# EasyEDA Pro project Board1.epro

# Board PCB1
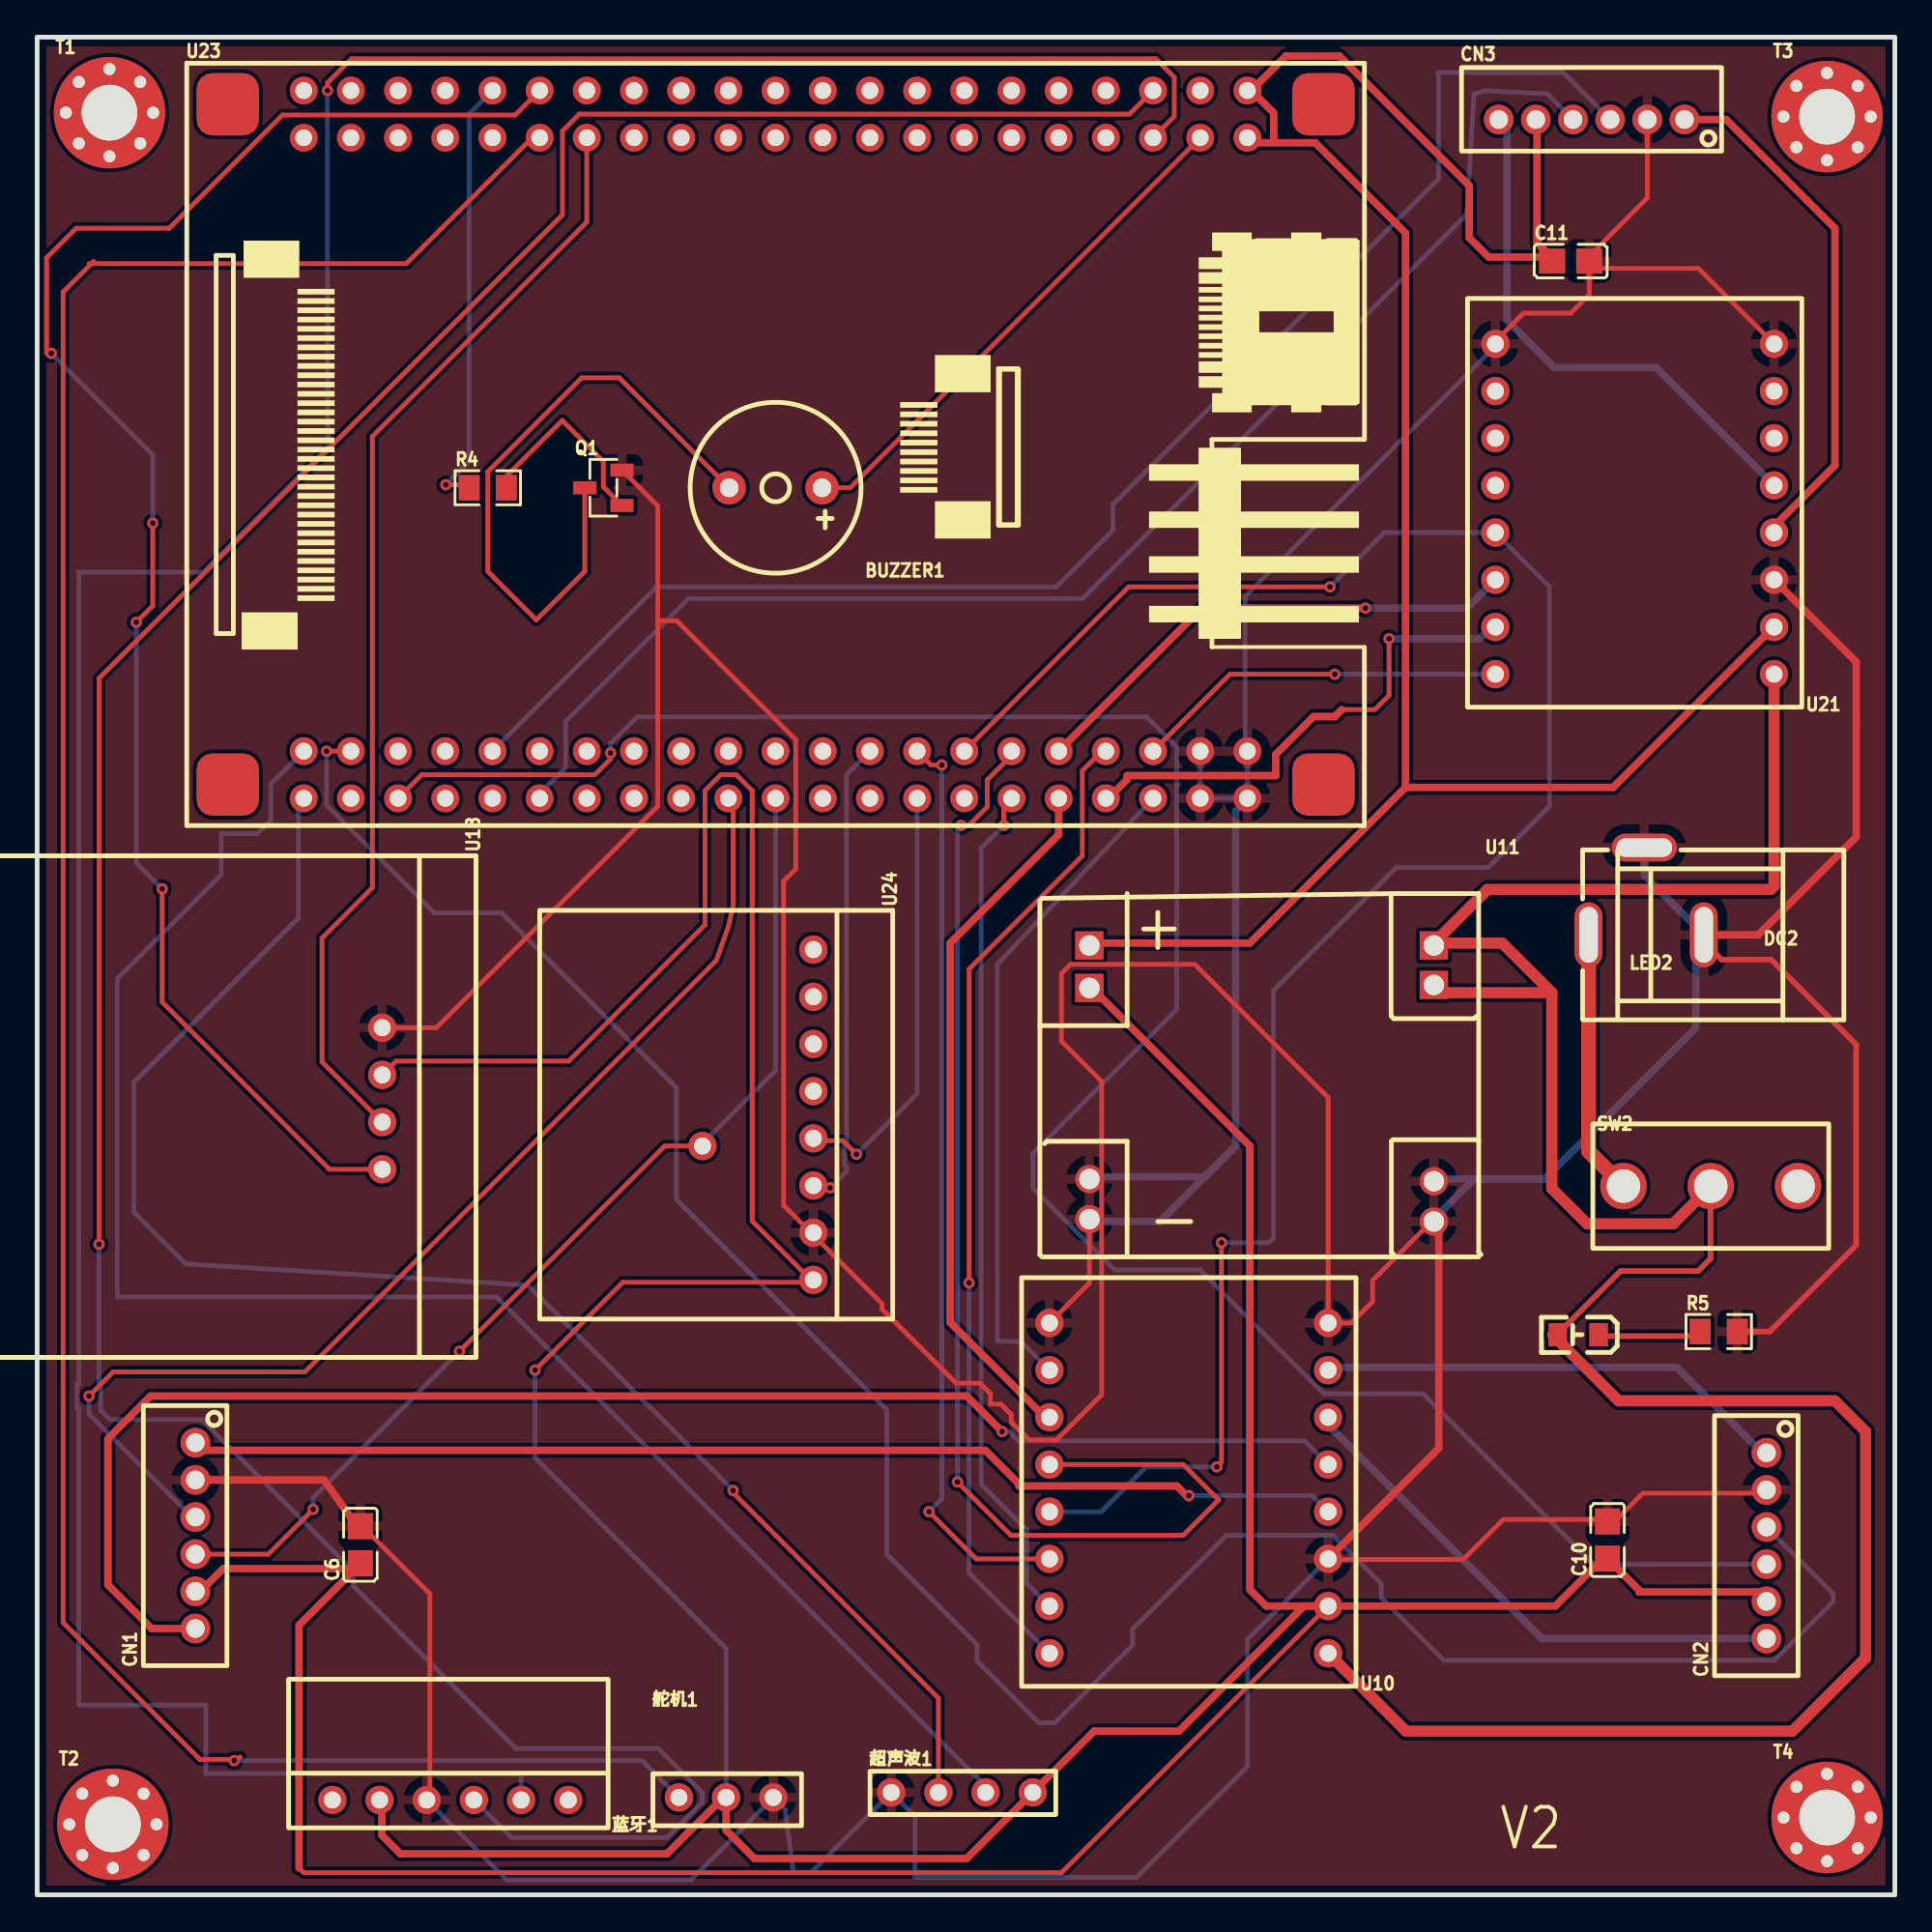
[diagram p0: board, top side]
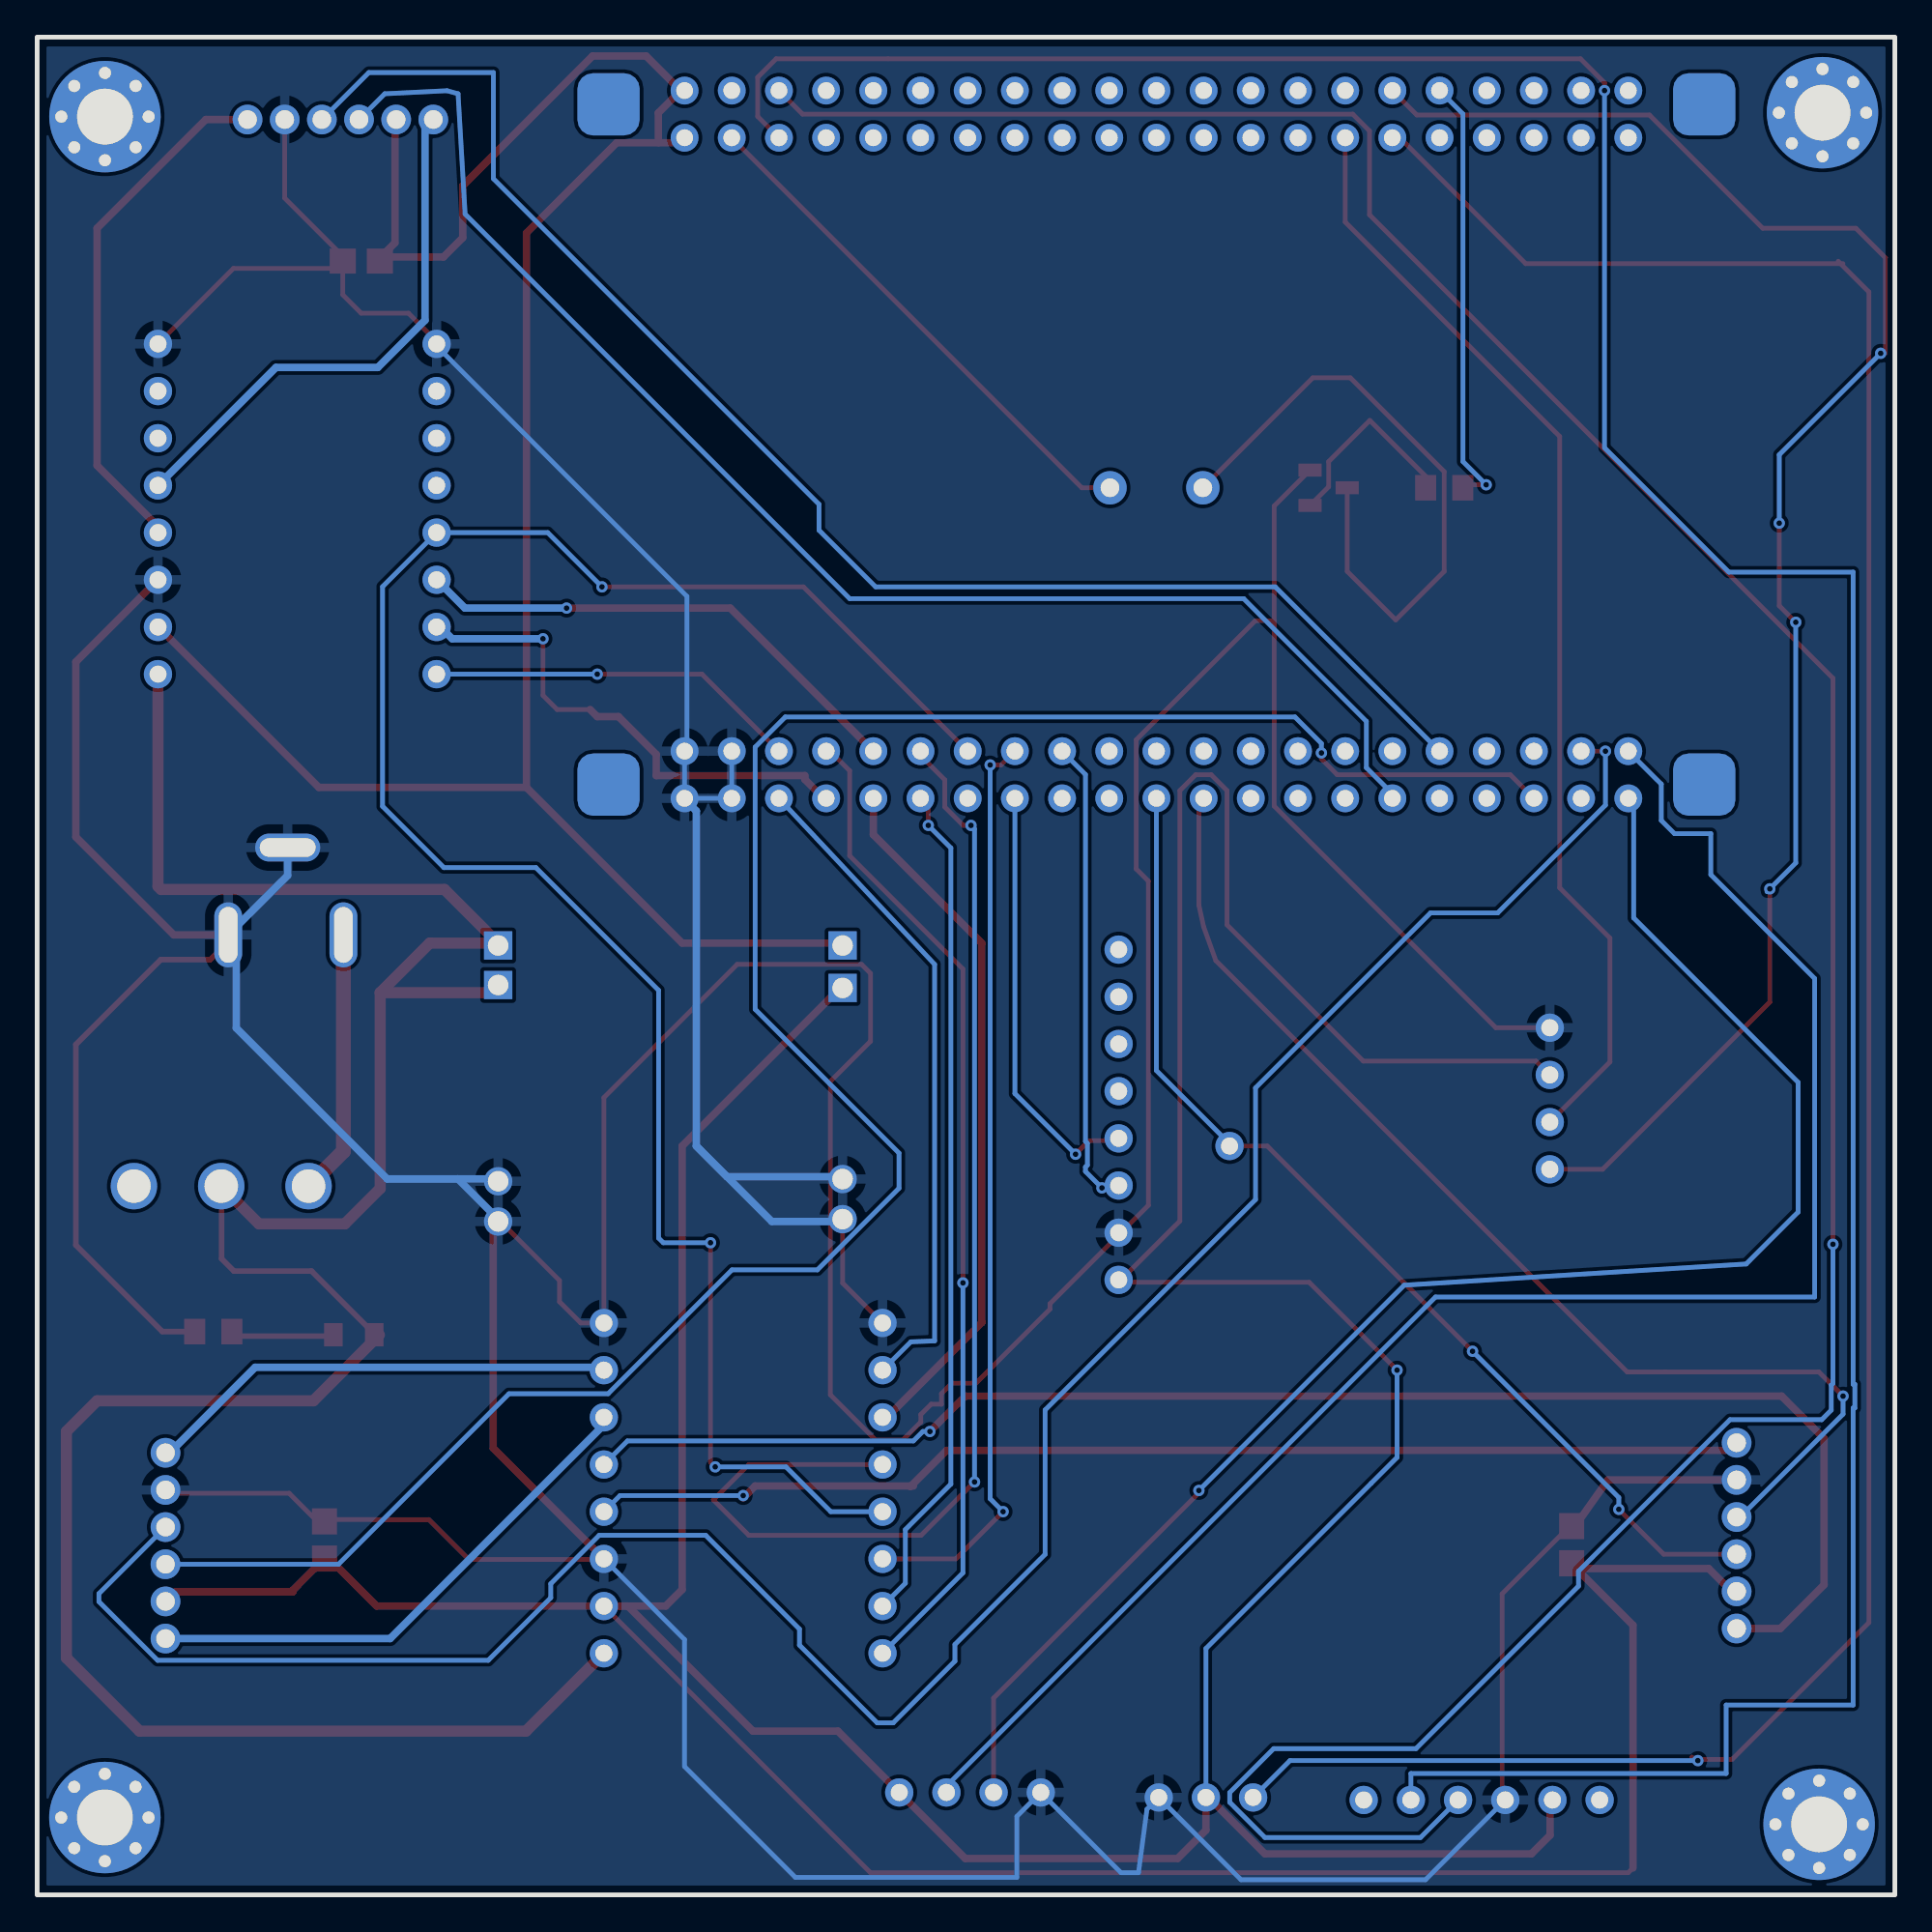
[diagram p1: board, bottom side, seen from below]

Outline 100 x 100 mm; copper layers: Top Layer, Bottom Layer. Coordinates in mm from the lower left corner of the outline.
Outline path: rectangle 0,100 100,0
Stack: Top Layer 0.035mm / Dielectric1 1.51mm FR4 er 4.5 / Bottom Layer 0.035mm

## Design rules (mm)
template: JLCPCB Capability(Two Layers Board)
spacing copperThickness1oz (default): track to track 0.102, other pairs 0.152 to 0.3
spacing copperThickness2oz: track to track 0.203, other pairs 0.152 to 0.3
track width copperThickness1oz (default): min 0.127, default 0.254, max 2.54
track width copperThickness2oz: min 0.203, default 0.254, max 2.54
differential pair differentialPair (default): width min 0.127, default 0.254, max 2.54; gap min 0.152, default 0.152
via viaSize (default): diameter min 0.5, default 0.61, max 10; hole min 0.3, default 0.305, max 6.3

## Placement (name value [footprint] x y rotation side)
BUZZER1  3kHz  [BUZ-TH_BD9.0-P5.00-D0.6-FD]  39.75 75.74 180 top
C6  100nF  [C0805]  17.4 18.85 90 top
C10  100nF  [C0805]  84.53 19.1 90 top
C11  100nF  [C0805]  82.55 87.95 0 top
CN1  电机1  [CONN-TH_B6B-PH-K-S]  8.52 19.34 90 top
CN2  电机2  [CONN-TH_B6B-PH-K-S]  93.09 18.8 90 top
CN3  电机3  [CONN-TH_B6B-PH-K-S]  83.67 95.57 0 top
DC2  DC-470-2.1GP  [DC-IN-TH_DC-470-2.1GP]  86.61 54.03 180 top
LED2  NCD0805R1  [LED0805-RD_RED]  82.96 30.15 180 top
NOREF  -  [Pad_e14953]  35.81 40.31 0 top
Q1  MMBT3904  [SOT-23-3_L2.9-W1.3-P1.90-LS2.4-BR]  30.48 75.74 0 top
R4  4.7kΩ  [R0805]  24.26 75.74 0 top
R5  10kΩ  [R0805]  90.52 30.32 0 top
SW2  SS-12D10L5  [SW-TH_SS-12D10L5]  90.09 38.15 0 top
T1  M3.0螺丝孔(无网络)  [螺钉孔3.0]  3.89 95.93 0 top
T2  M3.0螺丝孔(无网络)  [螺钉孔3.0]  4.08 3.8 0 top
T3  M3.0螺丝孔(无网络)  [螺钉孔3.0]  96.35 95.72 0 top
T4  M3.0螺丝孔(无网络)  [螺钉孔3.0]  96.35 4.16 0 top
U10  TB6612  [TB6612电机驱动模块排插]  70.99 11.23 180 top
U11  12-5  [电源]  75.18 36.37 180 top
U18  OLED  [0.96寸OLED模块]  20.57 55.93 270 top
U21  TB6612  [TB6612电机驱动模块排插]  95 63.93 180 top
U23  -  [stm32f407vet6]  39.75 77.69 0 top
U24  -  [MPU6050]  43.05 51.99 270 top
舵机1  -  [舵机接口3p]  36.96 5.37 0 top
蓝牙1  -  [hc-05蓝牙模块直插接口6p]  30.73 3.61 180 top
超声波1  -  [超声波模块]  46.99 4.5 0 top

## Footprints (pads in the part's own frame, mm; a bottom-side part is the same pattern mirrored in y, then rotated)
0.96寸OLED模块
  round 1.524 hole 0.914: 1(9.254,-2) 2(11.794,-2) 3(14.334,-2) 4(16.874,-2)
BUZ-TH_BD9.0-P5.00-D0.6-FD
  round 1.8 hole 1: 1(-2.5,0) 2(2.5,0)
C0805
  rect 1.41x1.35 smd: 1(-1,0) 2(1,0)
CONN-TH_B6B-PH-K-S
  round 1.6 hole 1: 1(5,0) 2(3,0) 3(1,0) 4(-1,0) 5(-3,0) 6(-5,0)
DC-IN-TH_DC-470-2.1GP
  oval 1.5x3.5 hole 1x3: 1(3.1,2.35) 2(-3.1,2.35)
  oval 3.5x1.5 hole 3x1: 3(0.1,-2.35)
hc-05蓝牙模块直插接口6p
  round 1.524 hole 0.914: 1(2.143,-1.5) 2(4.683,-1.5) 3(7.223,-1.5) 4(9.763,-1.5) 5(12.303,-1.5) 6(14.843,-1.5)
LED0805-RD_RED
  rect 1x1.25 smd: 1(-1.1,0) 2(1.1,0)
MPU6050
  round 1.524 hole 0.914: 1(18.891,-1.27) 2(16.351,-1.27) 3(13.811,-1.27) 4(11.271,-1.27) 5(8.731,-1.27) 6(6.191,-1.27) 7(3.651,-1.27) 8(1.111,-1.27)
Pad_e14953
  round 1.524 hole 0.914: 88(0,0)
R0805
  rect 1.133x1.377 smd: 1(-1,0) 2(1,0)
SOT-23-3_L2.9-W1.3-P1.90-LS2.4-BR
  rect 1.25x0.7 smd: 1(1,-0.95) 2(1,0.95) 3(-1,0)
stm32f407vet6
  custom 3.35x3.35 hole 3.005x3: 0(29.49,-17.929) 85(-29.49,-17.929) 87(29.49,18.691)
  round 1.5 hole 0.9: 1(25.397,19.431) 2(25.397,16.891) 3(22.857,19.431) 4(22.857,16.891) 5(20.317,19.431) 6(20.317,16.891) 7(17.777,19.431) 8(17.777,16.891) 9(15.237,19.431) 10(15.237,16.891) 11(12.697,19.431) 12(12.697,16.891) 13(10.157,19.431) 14(10.157,16.891) 15(7.617,19.431) 16(7.617,16.891) 17(5.077,19.431) 18(5.077,16.891) 19(2.537,19.431) 20(2.537,16.891) 21(-0.003,19.431) 22(-0.003,16.891) 23(-2.543,19.431) 24(-2.543,16.891) 25(-5.083,19.431) 26(-5.083,16.891) 27(-7.623,19.431) 28(-7.623,16.891) 29(-10.163,19.431) 30(-10.163,16.891) 31(-12.703,19.431) 32(-12.703,16.891) 33(-15.243,19.431) 34(-15.243,16.891) 35(-17.783,19.431) 36(-17.783,16.891) 37(-20.323,19.431) 38(-20.323,16.891) 39(-22.863,19.431) 40(-22.863,16.891) 41(-25.403,19.431) 42(-25.403,16.891) 43(25.397,-16.129) 44(25.397,-18.669) 45(22.857,-16.129) 46(22.857,-18.669) 47(20.317,-16.129) 48(20.317,-18.669) 49(17.777,-16.129) 50(17.777,-18.669) 51(15.237,-16.129) 52(15.237,-18.669) 53(12.697,-16.129) 54(12.697,-18.669) 55(10.157,-16.129) 56(10.157,-18.669) 57(7.617,-16.129) 58(7.617,-18.669) 59(5.077,-16.129) 60(5.077,-18.669) 61(2.537,-16.129) 62(2.537,-18.669) 63(-0.003,-16.129) 64(-0.003,-18.669) 65(-2.543,-16.129) 66(-2.543,-18.669) 67(-5.083,-16.129) 68(-5.083,-18.669) 69(-7.623,-16.129) 70(-7.623,-18.669) 71(-10.163,-16.129) 72(-10.163,-18.669) 73(-12.703,-16.129) 74(-12.703,-18.669) 75(-15.243,-16.129) 76(-15.243,-18.669) 77(-17.783,-16.129) 78(-17.783,-18.669) 79(-20.323,-16.129) 80(-20.323,-18.669) 81(-22.863,-16.129) 82(-22.863,-18.669) 83(-25.403,-16.129) 84(-25.403,-18.669)
  custom 3.35x3.35 hole 3x3.005: 86(-29.49,18.691)
SW-TH_SS-12D10L5
  round 2.5 hole 1.8: 1(-4.7,0) 2(0,0) 3(4.7,0)
TB6612电机驱动模块排插
  round 1.524 hole 0.914: 1(1.5,-1.778) 2(1.5,-4.318) 3(1.5,-6.858) 4(1.5,-9.398) 5(1.5,-11.938) 6(1.5,-14.478) 7(1.5,-17.018) 8(1.5,-19.558) 9(16.5,-19.558) 10(16.5,-17.018) 11(16.5,-14.478) 12(16.5,-11.938) 13(16.5,-9.398) 14(16.5,-6.858) 15(16.5,-4.318) 16(16.5,-1.778)
电源
  round 1.524 hole 1.1: 1(0,0.127) 2(0,-2.04) 3(18.542,0) 4(18.542,-2.159)
  rect 1.524x1.524 hole 1.1: 5(0,-12.604) 6(0,-14.732) 7(18.542,-12.446) 8(18.542,-14.732)
舵机接口3p
  round 1.524 hole 0.914: 1(-2.413,-0.127) 2(0.127,-0.127) 3(2.667,-0.127)
螺钉孔3.0
  round 6 hole 3: 1(0,0)
  round 1 hole 0.65: 2(0,2.349) 3(0,-2.349) 4(2.349,0) 5(-2.349,0) 6(1.651,1.651) 7(-1.651,-1.651) 8(1.651,-1.651) 9(-1.651,1.651)
超声波模块
  round 1.524 hole 0.914: 1(-1.016,1.016) 2(1.524,1.016) 3(4.064,1.016) 4(6.604,1.016)

## Nets
3.3V: BUZZER1.1 U23.3 U23.4
+5V: C6.1 C10.1 C11.1 CN1.5 CN2.5 CN3.5 U10.2 U11.7 U11.8 U18.2 U21.2 U23.1 U23.2 U24.1 舵机1.2 蓝牙1.5 超声波1.4
GND: C6.2 C10.2 C11.2 CN1.2 CN2.2 CN3.2 DC2.2 DC2.3 Q1.2 R5.2 U10.3 U10.8 U10.9 U11.1 U11.2 U11.3 U11.4 U18.1 U21.3 U21.8 U21.9 U23.43 U23.44 U23.45 U23.46 U24.2 舵机1.3 蓝牙1.4 超声波1.1
VCC: LED2.2 SW2.2 U10.1 U11.5 U11.6 U21.1
AIN1: U10.14 U23.57
AIN2: U10.15 U23.54
AO1: CN1.1 U10.4
AO2: CN1.6 U10.5
BIN1: U10.12 U23.53
BIN2: U10.11 U23.52
BO1: CN2.1 U10.7
BO2: CN2.6 U10.6
CIN1: U21.14 U23.51
CIN2: U21.15 U23.50
CO1: CN3.1 U21.4
CO2: CN3.6 U21.5
PA0: CN2.3 U23.81
PA1: CN2.4 U23.80
PA6: CN3.3 U23.75
PA7: CN3.4 U23.74
PB8: U23.32 舵机1.1
PB9: R4.1 U23.33
PC1: U23.84 超声波1.2
PC2: U23.83 超声波1.3
PE9: CN1.3 U23.66
PE11: CN1.4 NOREF.88 U23.64
PWMA: U10.16 U23.49
PWMB: U10.10 U23.48
PWMC: U21.16 U23.47
RX: U23.5 蓝牙1.3
SCL: U18.3 U23.30
SCL2: U23.59 U24.3
SDA: U18.4 U23.31
SDA2: U23.58 U24.4
STBY: U10.13 U21.13 U23.55
TX: U23.6 蓝牙1.2
$1N1743: BUZZER1.2 Q1.3
$1N1748: Q1.1 R4.2
$1N3498: DC2.1 SW2.1
$1N3503: LED2.1 R5.1

Pads without a net: SW2 3; T1 1 2 3 4 5 6 7 8 9; T2 1 2 3 4 5 6 7 8 9; T3 1 2 3 4 5 6 7 8 9; T4 1 2 3 4 5 6 7 8 9; U21 6 7 10 11 12; U23 0 7 8 9 10 11 12 13 14 15 16 17 18 19 20 21 22 23 24 25 26 27 28 29 34 35 36 37 38 39 40 41 42 56 60 61 62 63 65 67 68 69 70 71 72 73 76 77 78 79 82 85 86 87; U24 5 6 7 8; 蓝牙1 1 6

## Via types
v1: diameter 0.61, hole 0.305, Top Layer to Bottom Layer, 31 vias

## Routing (per net, layer and track width the routed paths; a pad name or vN(x,y) marks a point on that pad's centre or on a via; arc(x,y) is an arc through that point)
+5V: length 438.6
  Top Layer w0.254: v1(26.8,28.25) 31.53,32.98 41.78,32.98 38.49,36.27 38.49,59.44 37.64,60.3 36.8,60.3 35.95,59.44 35.95,52.22 28.61,44.88 19.32,44.88 U18.2 ; U10.2 55.14,1.19 14.35,1.19 14.1,1.45
  Top Layer w0.4: 8.51,16.05 10.02,17.56 17.14,17.56 ; 17.38,17.8 14.1,14.52 14.1,1.45 ; 18.56,5.11 18.56,3.21 19.56,2.21 33.91,2.21 36.96,5.26 ; 舵机1.2 37.08,3.48 38.61,1.96 50.04,1.96 56.9,8.81 61.47,8.81 68.2,15.54 69.66,15.54 ; 56.64,51.23 65.28,51.23 73.66,59.61 ; 56.64,48.95 65.28,40.31 65.28,16.43 66.17,15.54 69.66,15.54 ; 73.66,59.61 73.66,89.46 68.8,94.32 65.15,94.32 ; 73.66,59.61 84.84,59.61 93.35,68.12 ; 65.36,97.13 65.15,97.13 ; 65.36,97.13 67.22,98.98 70.1,98.98 77.09,92 77.09,89.2 78.13,88.17 81.9,88.17 ; 65.36,97.13 66.56,95.92 66.56,94.32 ; 69.66,15.54 81.72,15.54 84.23,18.05 ; 80.74,95.25 80.74,88.93 81.5,88.17 ; C10.1 86.23,16.4 86.23,16.31 92.58,16.31 93.04,15.85
  Bottom Layer w0.254: v1(26.8,28.25) 26.8,23.55 37.08,13.26 舵机1.2
GND: length 501.9
  Top Layer w0.254: 17.4,19.95 21.14,16.21 21.14,4.94 ; 56.64,36.25 56.64,32.93 U10.9 ; 69.31,18.05 76.76,18.05 78.91,20.2 84.82,20.2 84.92,20.1 86.43,21.62 93.09,21.62 ; 75.18,36.37 71.88,33.07 71.88,31.93 70.74,30.78 U10.8 69.49,42.91 62.32,50.09 55.63,50.09 55.14,49.6 55.14,45.95 57.3,43.78 57.3,26.92 54.87,24.49 53.4,24.49 52.43,25.45 52.43,25.86 51.88,26.41 51.32,26.41 51.32,26.98 50.75,27.54 49.47,27.54 45.48,31.53 45.48,31.82 40.18,37.12 40.18,54.57 40.84,55.23 40.84,62.17 34.42,68.59 33.41,68.59 ; 78.23,83.36 80.01,85.14 82.56,85.14 83.55,86.13 C11.2 ; 83.65,88.31 86.67,91.34 CN3.2 ; 83.65,87.55 89.43,87.55 U21.8 ; Q1.2 33.41,74.76 33.41,68.59 ; 33.41,68.59 33.41,58.61 21.48,46.68 U18.1
  Top Layer w0.3: 89.66,51.36 90.68,50.34 93.35,50.34 97.92,45.77 97.92,34.98 93.26,30.32 91.82,30.32
  Top Layer w0.4: CN1.2 15.45,22.34 17.02,20.12 ; 75.45,36.64 75.45,24.04 U10.3 ; 89.85,51.68 92.65,51.68 97.92,56.95 97.92,66.37 U21.3
  Bottom Layer w0.254: 45.72,5 45.72,5.26 45.97,5.51 47.26,4.22 47.26,0.94 59.18,0.94 65.15,6.91 65.15,13.74 U10.3 ; 45.85,5.38 41.66,1.19 40.71,1.19 40.26,4.61 舵机1.3 35.19,0.81 25.27,0.81 蓝牙1.4 ; 62.61,59.03 62.61,61.57 ; 62.61,59.03 62.86,59.03 62.86,58.98 ; 62.61,59.03 65.15,59.03 65.15,61.57 ; 78.23,83.11 65.02,69.9 65.02,61.45
  Bottom Layer w0.4: 56.64,38.66 62.86,38.66 64.52,40.31 ; 56.64,36.25 60.45,36.25 64.52,40.31 ; 64.52,40.31 64.52,58.34 65.02,58.85 ; 75.18,36.37 77.35,38.54 81.16,38.54 ; 81.16,38.54 75.18,38.54 ; 81.16,38.54 89.28,46.66 89.28,51.1 ; 86.51,56.38 86.51,54.88 DC2.2
AIN1: length 49.7
  Top Layer w0.254: U10.14 50.55,18.08 v1(48,20.63) ; 47.37,61.57 48.11,60.82 v1(48.7,60.82)
  Bottom Layer w0.254: v1(48.7,60.82) 48.7,21.32 v1(48,20.63)
AIN2: length 45.7
  Top Layer w0.254: v1(52.03,57.57) 52.03,58.61 U23.54
  Bottom Layer w0.254: v1(52.03,57.57) 50.82,56.35 50.82,22.11 53.26,19.66 53.26,16.77 U10.15
AO1: length 62.7
  Top Layer w0.4: 8.38,23.93 51.04,23.93 52.99,21.97 ; 52.83,22.01 61.35,22.01 61.99,21.37
  Bottom Layer w0.254: v1(61.99,21.49) 68.62,21.49 U10.4
AO2: length 81.7
  Top Layer w0.4: CN1.6 6.16,14.34 3.81,16.69 3.81,24.56 6.1,26.85 50.04,26.85 v1(51.94,24.94)
  Bottom Layer w0.254: v1(51.94,24.94) 52.32,24.94 52.83,24.44 68.22,24.44 U10.5
BIN1: length 66.7
  Top Layer w0.254: U10.12 61.69,23.16 63.6,21.26 61.69,19.35 52.41,19.35 v1(49.54,22.23) ; v1(49.73,57.57) 50.15,57.57 51.14,58.56 51.14,60.02 52.45,61.33 U23.53
  Bottom Layer w0.254: v1(49.73,57.57) 49.54,57.38 v1(49.54,22.23)
CIN1: length 27.3
  Top Layer w0.4: 54.99,61.57 62.69,69.27 v1(71.5,69.27)
  Bottom Layer w0.4: v1(71.5,69.27) 76.97,69.27 U21.14
CIN2: length 27.2
  Top Layer w0.254: 70.23,63.8 72.01,63.8 72.77,64.57 v1(72.77,67.61)
  Top Layer w0.4: 57.53,58.9 58.67,60.04 58.67,60.25 66.67,60.25 66.67,61.39 68.71,63.42 69.85,63.42 70.23,63.8
  Bottom Layer w0.4: v1(72.77,67.61) 77.66,67.61 78.3,68.25
PA0: length 129.1
  Top Layer w0.254: v1(15.58,61.56) U23.81
  Bottom Layer w0.254: v1(15.58,61.56) 15.58,58.66 21.38,52.86 25,52.86 34.41,43.44 34.41,37.43 45.74,26.1 45.74,18.33 50.6,13.47 50.6,12.58 53.92,9.26 54.78,9.26 58.96,13.44 58.96,14.31 64.01,19.35 69.74,19.35 72.35,16.75 72.35,15.99 75.72,12.62 93.52,12.62 96.67,15.78 96.67,16.21 CN2.3
PA1: length 119.7
  Top Layer w0.254: 19.43,59.03 20.7,60.3 30.02,60.3 30.87,61.15 v1(30.87,61.47)
  Bottom Layer w0.254: v1(30.87,61.47) 30.87,61.98 32.29,63.41 59.72,63.41 61.35,61.78 61.35,47.67 53.61,39.93 53.61,38.04 58,33.64 62.6,33.64 69.26,26.97 74.6,26.97 83.78,17.8 CN2.4
PB8: length 138.6
  Top Layer w0.254: 3.05,87.93 1.4,86.28 1.4,14.66 8.76,7.29 10.8,7.29 10.92,7.42 ; 2.79,87.81 19.87,87.81 27.05,94.98
  Bottom Layer w0.254: v1(10.6,7.23) 32.56,7.23 舵机1.1
PB9: length 23.6
  Top Layer w0.254: v1(22,75.9) 23.1,75.9 R4.1
  Bottom Layer w0.254: 24.51,97.13 23.25,95.87 23.25,77.16 v1(22,75.9)
PC1: length 84.7
  Top Layer w0.254: 37.47,21.64 48.51,10.59 48.51,5.51
  Bottom Layer w0.254: 14.06,59.03 14.06,52.59 5.21,43.74 5.21,36.75 8,33.96 26.42,32.82 v1(37.47,21.77)
PE9: length 61.5
  Top Layer w0.254: v1(2.79,26.85) 4.09,28.15 14.41,28.15 36.55,50.29 37.21,52.12 37.47,53.27 37.47,58.77 37.21,59.03
  Bottom Layer w0.254: v1(2.79,26.85) 2.79,25.88 8.33,20.34 CN1.3
PE11: length 57
  Top Layer w0.254: 8.28,18.34 12.44,18.34 v1(14.86,20.75) ; v1(22.73,29.26) 33.78,40.31 NOREF.88
  Bottom Layer w0.254: v1(14.86,20.75) 14.86,21.39 v1(22.73,29.26) ; 39.75,58.76 39.75,44.37 35.81,40.44
PWMA: length 53.3
  Top Layer w0.254: v1(50.17,32.94) 50.17,49.83 56.26,55.93 56.26,60.51 57.32,61.57
  Bottom Layer w0.254: v1(50.17,32.94) 50.17,17.33 U10.16
PWMC: length 20.3
  Top Layer w0.254: U23.47 64.21,65.71 v1(69.85,65.71) 69.98,65.58
  Bottom Layer w0.254: v1(69.85,65.71) U21.16
RX: length 167.7
  Top Layer w0.254: U23.5 58.8,95.86 29.18,95.86 28.28,94.95 28.28,90.44 3.33,65.49 v1(3.33,35.02)
  Bottom Layer w0.254: 蓝牙1.3 25.53,3.08 33.91,3.08 35.8,4.98 35.8,5.5 33.44,7.87 25.78,7.87 17.03,16.62 17.03,17.42 8.87,25.58 3.94,25.58 3.42,26.09 3.42,27.44 3.33,27.53 v1(3.33,35.02)
SCL: length 60.2
  Top Layer w0.254: U18.3 15.34,44.83 15.34,51.5 18.04,54.21 18.04,78.51 29.59,90.05 29.59,94.59
SCL2: length 25.4
  Top Layer w0.254: v1(42.68,38.06) 41.78,38.06
  Bottom Layer w0.254: v1(42.68,38.06) 43.57,38.94 43.57,39.18 43.47,39.28 43.47,40.45 43.57,40.56 43.57,60.31 44.83,61.57
SDA: length 89.3
  Top Layer w0.254: 0.51,82.98 0.51,88.12 2.1,89.71 7.11,89.71 13.21,95.81 25.73,95.81 27.05,97.13 ; v1(6.22,73.84) 6.22,69.39 v1(5.33,68.5) ; v1(6.73,54.15) 6.73,48.06 15.73,39.06 U18.4
  Bottom Layer w0.254: v1(0.76,82.98) 6.22,77.52 v1(6.22,73.84) ; v1(5.33,68.5) 5.33,55.55 v1(6.73,54.15) 6.88,54
SDA2: length 23.1
  Top Layer w0.254: 41.78,40.6 43.37,40.6 v1(44.1,39.87)
  Bottom Layer w0.254: 47.37,59.03 47.37,43.13 v1(44.1,39.87)
STBY: length 106.8
  Top Layer w0.254: U23.55 58.75,70.41 v1(69.6,70.41) ; v1(63.75,35.1) 63.75,23.29 v1(63.5,23.04)
  Bottom Layer w0.254: U10.13 57.28,20.62 59.69,23.04 v1(63.5,23.04) ; v1(63.75,35.1) 66.29,35.1 66.55,35.36 66.55,48.69 73.15,55.3 78.11,55.3 81.41,58.6 81.41,70.42 U21.13 72.52,73.33 v1(69.6,70.41)
TX: length 176.2
  Top Layer w0.254: U23.6 61.21,95.73 61.21,97.84 60.22,98.84 16.92,98.84 15.63,97.54 v1(15.63,97.13)
  Bottom Layer w0.254: 蓝牙1.2 26.05,6.53 9.08,6.53 9.08,10.22 2.25,10.22 2.25,26.21 2.15,26.21 2.15,27.48 2.25,27.48 2.25,71.2 8.94,71.2 15.63,77.9 v1(15.63,97.13)
$1N1743: length 34.8
  Top Layer w0.254: BUZZER1.2 31.33,81.66 29.31,81.66 24.26,76.61 24.26,71.24 26.87,68.63 29.48,71.24 Q1.3
$1N1748: length 10.8
  Top Layer w0.254: R4.2 25.26,76.36 28.26,79.37 30.48,77.15 30.48,75.79 Q1.1
3.3V: length 28.2
  Top Layer w0.254: BUZZER1.1 43.77,75.74 62.61,94.59
VCC: length 142.7
  Top Layer w0.3: 81.82,30.17 85.23,33.58 89.41,33.58 90.07,34.24 90.07,37.85
  Top Layer w0.6: U10.1 73.68,8.81 94.49,8.81 98.42,12.75 98.42,24.94 96.77,26.59 85.13,26.59 81.58,30.14 ; 75.18,48.87 75.49,48.56 81.53,48.56 ; 81.53,48.56 78.87,51.23 75.18,51.23 78.07,54.12 93.33,54.12 93.5,54.29 U21.1 ; 81.53,48.56 81.53,38.02 83.44,36.12 88.06,36.12 90.07,38.13
BIN2: length 37.9
  Top Layer w0.4: 54.25,25.7 49.15,30.81 49.15,51.23 54.99,57.07 54.99,59.03
BO1: length 25.3
  Bottom Layer w0.4: 69.49,28.4 88.26,28.4 92.87,23.8
BO2: length 28.4
  Bottom Layer w0.4: 69.47,25.32 81,13.8 CN2.6
CO1: length 28.4
  Top Layer w0.4: CN3.1 90.92,95.57 96.77,89.71 96.77,76.94 93.16,73.33
CO2: length 29
  Bottom Layer w0.4: CN3.6 79.12,95.12 79.12,84.76 81.66,82.22 87.15,82.22 U21.5
PA6: length 80.5
  Bottom Layer w0.254: 24.51,61.57 33.35,70.41 54.86,70.41 57.91,73.46 57.91,74.85 75.44,92.38 75.44,98.09 82.15,98.09 CN3.3
PA7: length 76.7
  Bottom Layer w0.254: 27.05,59.28 28.45,60.68 28.45,63.17 35.05,69.77 56.26,69.77 76.96,90.47 77.34,96.95 77.93,97.12 81.29,96.95 CN3.4
PC2: length 92.3
  Bottom Layer w0.254: U23.83 12.57,59.79 12.57,57.84 11.86,57.12 9.91,57.12 9.91,54.91 4.32,49.33 4.32,32.18 24.73,32.18 51.05,5.85
PWMB: length 36
  Bottom Layer w0.254: U10.10 52.97,29.77 51.69,29.82 51.69,50.09 U23.48
$1N3498: length 14.3
  Top Layer w0.8: 83.51,51.68 83.51,40.03 SW2.1
$1N3503: length 5.5
  Top Layer w0.3: 84.06,30.07 89.2,30.07 89.45,30.32

## Copper pours and planes (outline as drawn; the poured copper is in the pictures)
GND on Top Layer: 0,99.87 100,99.87 100,-0.13 0,-0.13
GND on Bottom Layer: 0,99.75 100,99.75 100,0.13 0,0.13

## Text on the board
Top Silkscreen Layer: V2
